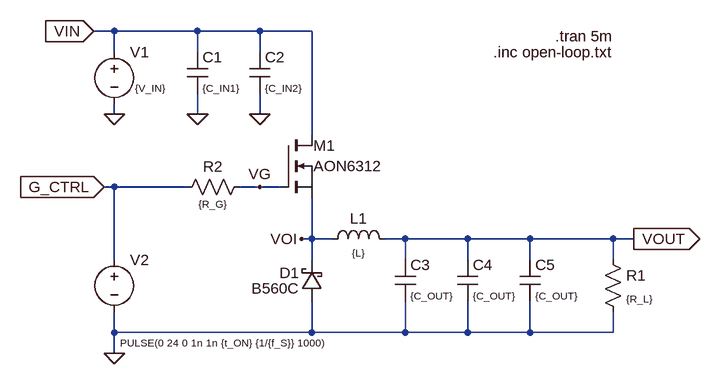
[diagram p0: schematic open-loop.asc]
open-loop.asc, the LTspice schematic file:
Version 4
SHEET 1 1020 680
WIRE 96 -192 64 -192
WIRE 224 -192 96 -192
WIRE 320 -192 224 -192
WIRE 400 -192 320 -192
WIRE 96 -160 96 -192
WIRE 224 -160 224 -192
WIRE 320 -160 320 -192
WIRE 96 -64 96 -80
WIRE 224 -64 224 -96
WIRE 320 -64 320 -96
WIRE 400 -32 400 -192
WIRE 96 48 80 48
WIRE 208 48 96 48
WIRE 320 48 288 48
WIRE 352 48 320 48
WIRE 400 128 400 64
WIRE 400 128 384 128
WIRE 432 128 400 128
WIRE 544 128 512 128
WIRE 640 128 544 128
WIRE 736 128 640 128
WIRE 864 128 736 128
WIRE 896 128 864 128
WIRE 96 160 96 48
WIRE 400 160 400 128
WIRE 544 160 544 128
WIRE 640 160 640 128
WIRE 736 160 736 128
WIRE 864 160 864 128
WIRE 96 272 96 240
WIRE 400 272 400 224
WIRE 400 272 96 272
WIRE 544 272 544 224
WIRE 544 272 400 272
WIRE 640 272 640 224
WIRE 640 272 544 272
WIRE 736 272 736 224
WIRE 736 272 640 272
WIRE 864 272 864 240
WIRE 864 272 736 272
WIRE 96 304 96 272
FLAG 224 -64 0
FLAG 320 -64 0
FLAG 96 -64 0
FLAG 64 -192 VIN
IOPIN 64 -192 In
FLAG 896 128 VOUT
IOPIN 896 128 Out
FLAG 96 304 0
FLAG 320 48 VG
FLAG 384 128 VOI
FLAG 80 48 G_CTRL
IOPIN 80 48 In
SYMBOL nmos 352 -32 R0
WINDOW 0 51 16 Left 2
WINDOW 3 51 48 Left 2
SYMATTR InstName M1
SYMATTR Value AON6312
SYMBOL ind 416 144 R270
WINDOW 0 32 56 VTop 2
WINDOW 3 5 56 VBottom 1
SYMATTR InstName L1
SYMATTR Value {L}
SYMBOL cap 208 -160 R0
WINDOW 3 24 56 Left 1
SYMATTR Value {C_IN1}
SYMATTR InstName C1
SYMBOL cap 304 -160 R0
WINDOW 3 24 56 Left 1
SYMATTR Value {C_IN2}
SYMATTR InstName C2
SYMBOL cap 528 160 R0
WINDOW 3 24 56 Left 1
SYMATTR Value {C_OUT}
SYMATTR InstName C3
SYMBOL cap 624 160 R0
WINDOW 3 24 56 Left 1
SYMATTR Value {C_OUT}
SYMATTR InstName C4
SYMBOL cap 720 160 R0
WINDOW 3 24 56 Left 1
SYMATTR Value {C_OUT}
SYMATTR InstName C5
SYMBOL res 848 144 R0
WINDOW 3 36 76 Left 1
SYMATTR Value {R_L}
SYMATTR InstName R1
SYMBOL voltage 96 -176 R0
WINDOW 3 32 72 Left 1
SYMATTR Value {V_IN}
SYMATTR InstName V1
SYMBOL res 304 32 R90
WINDOW 0 0 56 VBottom 2
WINDOW 3 32 56 VTop 1
SYMATTR InstName R2
SYMATTR Value {R_G}
SYMBOL voltage 96 144 R0
WINDOW 3 9 144 Left 1
WINDOW 123 0 0 Left 0
WINDOW 39 0 0 Left 0
SYMATTR Value PULSE(0 24 0 1n 1n {t_ON} {1/{f_S}} 1000)
SYMATTR InstName V2
SYMBOL schottky 416 224 R180
WINDOW 0 35 44 Left 2
WINDOW 3 35 20 Left 2
SYMATTR InstName D1
SYMATTR Value B560C
TEXT 864 -160 Right 2 !.inc open-loop.txt
TEXT 864 -184 Right 2 !.tran 5m

The netlist it stands for:
* open-loop.asc
M1 VIN VG VOI VOI AON6312
L1 VOI VOUT {L}
C1 VIN 0 {C_IN1}
C2 VIN 0 {C_IN2}
C3 VOUT 0 {C_OUT}
C4 VOUT 0 {C_OUT}
C5 VOUT 0 {C_OUT}
R1 VOUT 0 {R_L}
V1 VIN 0 {V_IN}
R2 VG G_CTRL {R_G}
V2 G_CTRL 0 PULSE(0 24 0 1n 1n {t_ON} {1/{f_S}} 1000)
D1 0 VOI B560C
.model D D
.lib standard.dio
.model NMOS NMOS
.model PMOS PMOS
.lib standard.mos
.inc open-loop.txt
.tran 5m
.backanno
.end